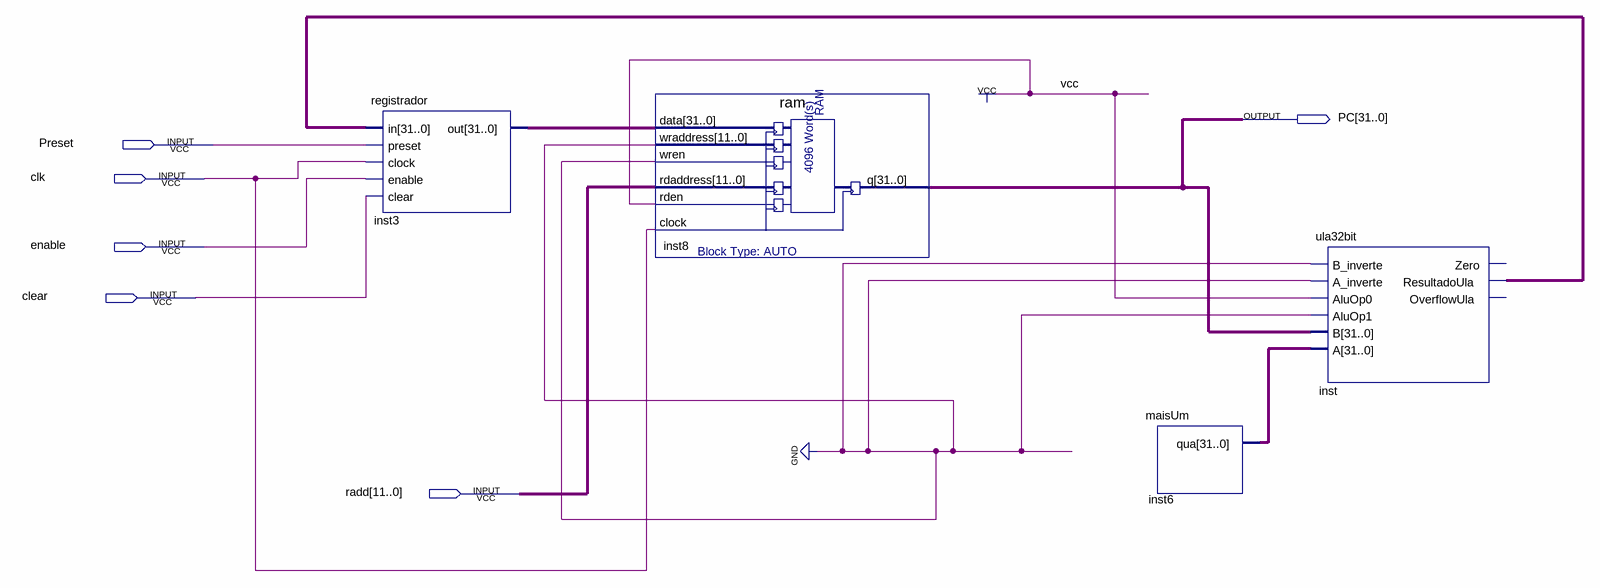
[diagram p0: schematic sheet]
// Quartus schematic processador.bdf as structural Verilog: 4 symbols, 6 pins
module processador (
  input  Preset,
  input  clk,
  input  enable,
  input  clear,
  input  [11:0] radd,
  output [31:0] PC
);

  wire vcc;
  wire [31:0] inst3_out, inst6_qua, inst_resultadoula;

  registrador inst3 (
    .in(inst_resultadoula), .preset(Preset), .clock(clk), .enable(enable), .clear(clear), .out(inst3_out));
  ram inst8 (.data(inst3_out), .wraddress({12{1'b0}}), .wren(1'b0), .rdaddress(radd), .rden(vcc), .clock(clk), .q(PC));
  maisUm inst6 (.qua(inst6_qua));
  ula32bit inst (
    .B_inverte(1'b0), .A_inverte(1'b0), .AluOp0(vcc), .AluOp1(1'b0), .B(PC), .A(inst6_qua),
    .ResultadoUla(inst_resultadoula));  // open: Zero, OverflowUla
endmodule
